# EAGLE design WeightGauge (EAGLE 8.2.1)
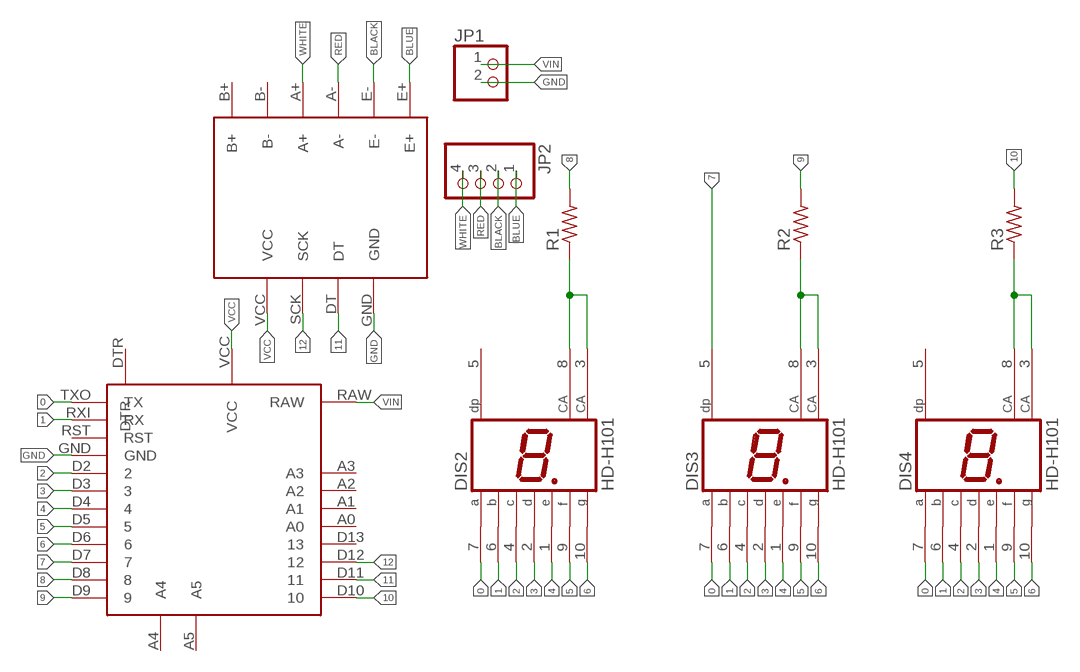
[diagram p0: schematic, sheet 1]

## Parts
DIS2  HD-H101  [HDSP-M]
DIS3  HD-H101  [HDSP-M]
DIS4  HD-H101  [HDSP-M]
JP1  PINHD-1X2/90  [1X02/90]
JP2  PINHD-1X4/90  [1X04/90]
R1  R-US_R1206  [R1206]
R2  R-US_R1206  [R1206]
R3  R-US_R1206  [R1206]
U$1  ARDUINO_PRO_MINI  [ARDUINO_PRO_MINI]
U$2  HX711  [HX711]

## Nets
0: DIS2.7(A) DIS3.7(A) DIS4.7(A) U$1.TXO(TX)
1: DIS2.6(B) DIS3.6(B) DIS4.6(B) U$1.RXI(RX)
2: DIS2.4(C) DIS3.4(C) DIS4.4(C) U$1.D2
3: DIS2.2(D) DIS3.2(D) DIS4.2(D) U$1.D3
4: DIS2.1(E) DIS3.1(E) DIS4.1(E) U$1.D4
5: DIS2.9(F) DIS3.9(F) DIS4.9(F) U$1.D5
6: DIS2.10(G) DIS3.10(G) DIS4.10(G) U$1.D6
7: DIS3.5(DP) U$1.D7
8: R1.2 U$1.D8
9: R2.2 U$1.D9
10: R3.2 U$1.D10
11: U$1.D11 U$2.DT
12: U$1.D12 U$2.SCK
BLACK: JP2.2 U$2.E-
BLUE: JP2.1 U$2.E+
GND [VCC]: JP1.2 U$1.GND U$2.GND
N$1: DIS2.3(CA) DIS2.8(CA) R1.1
N$2: DIS3.3(CA) DIS3.8(CA) R2.1
N$5: DIS4.3(CA) DIS4.8(CA) R3.1
RED: JP2.3 U$2.A-
VCC [VCC]: U$1.VCC U$2.VCC
VIN [VIN]: JP1.1 U$1.RAW
WHITE: JP2.4 U$2.A+
Unconnected: DIS2.5(DP) DIS4.5(DP) U$1.A0 U$1.A1 U$1.A2 U$1.A3 U$1.A4 U$1.A5 U$1.D13 U$1.DTR U$1.RST U$2.B+ U$2.B-

## Library data of the parts
DIS2-DIS4 = display-hp:HD-H101: LED DISPLAY 1-character 7 segment, decimal point right; OC_FARNELL: unknown; OC_NEWARK: unknown
JP1 = pinhead:PINHD-1X2: PIN HEADER
JP2 = pinhead:PINHD-1X4: PIN HEADER
R1-R3 = rcl:R-US_: RESISTOR, American symbol
U$1 = unclepetes:ARDUINO_PRO_MINI
U$2 = HX711:HX711

## Net classes
0 default: width 0.406 mm
1 VIN: width 0.61 mm
2 VCC: width 0.406 mm

## Board
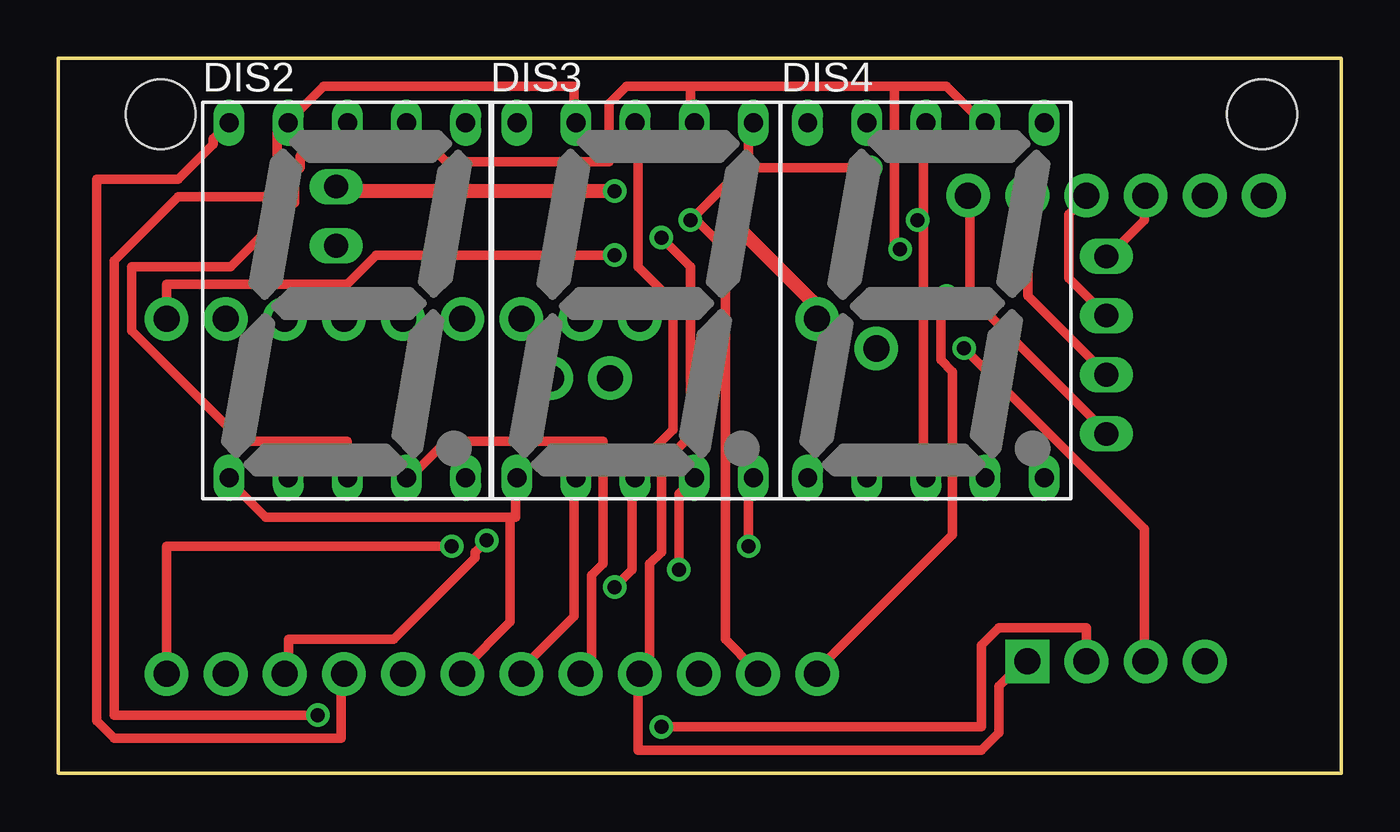
[diagram p1: board, top side]
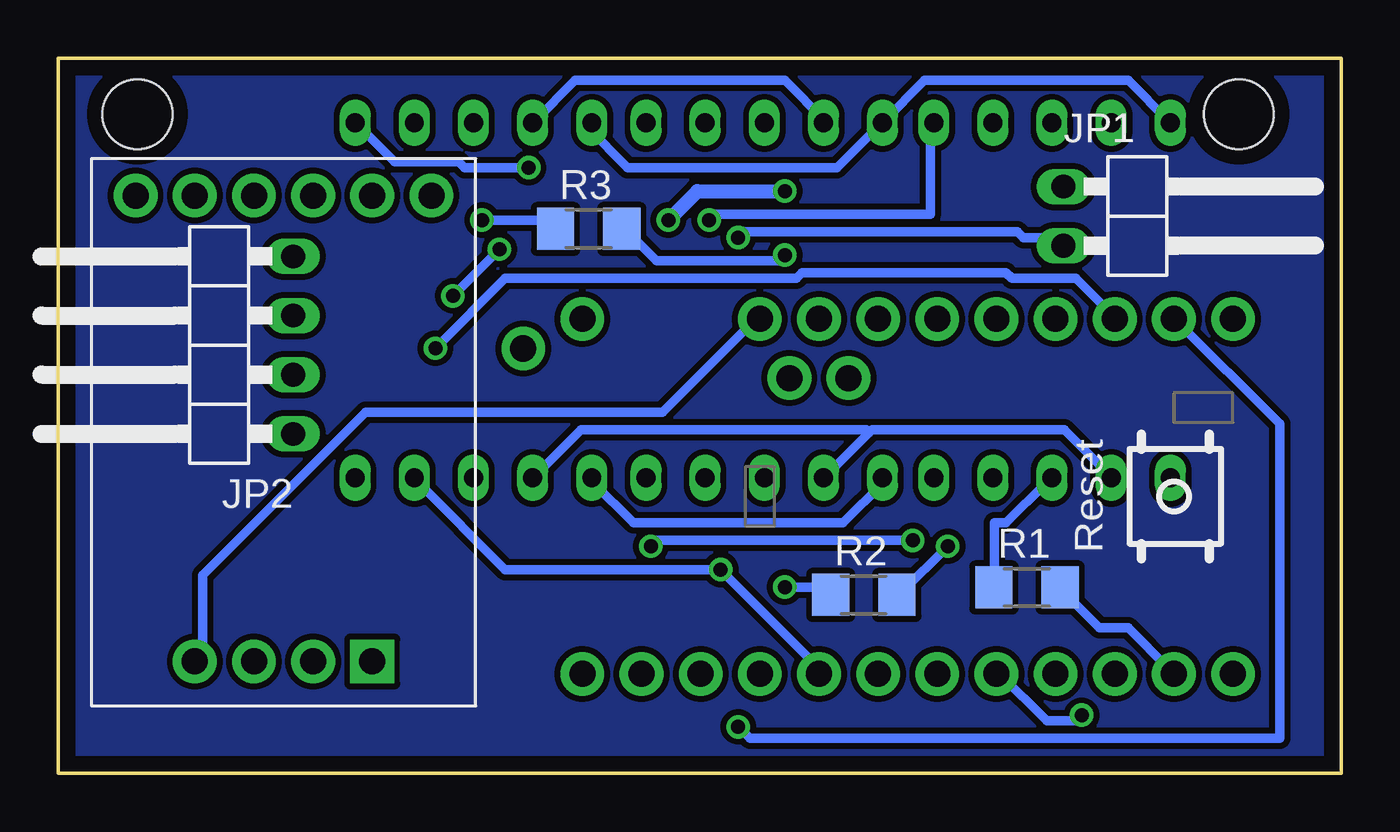
[diagram p2: board, bottom side, seen from below]

Size 55.1 x 30.7 mm. Coordinates in mm from the lower left corner, seen from the top.
Outline: 0,0 55.1,0 55.1,30.7 0,30.7 0,0
Copper layers (1*16): Top 0.035mm / dielectric 1.5mm / Bottom 0.035mm
Design rules "default *": minimum track width 10mil, minimum drill 0.6mm, track to track 10mil, track to pad 10mil, pad to pad 10mil, via to via 12mil, smd to smd 8mil, copper to edge 26mil, drill to drill 12mil, minimum pad ring 10mil, minimum via ring 8mil, stop-mask expansion 1mil, vias tented up to drill 30mil, thermal gap 10mil
Holes 3 mm at 51.7,28.3 4.4,28.3

### Footprints (pad centres in the part's own frame; a part is rotated, then mirrored left to right if it is on the bottom)
HDSP-M = drill 0.813 long: 1 -5.08,-7.62; 2 -2.54,-7.62; 3 0,-7.62; 4 2.54,-7.62; 5 5.08,-7.62; 6 5.08,7.62; 7 2.54,7.62; 8 0,7.62; 9 -2.54,7.62; 10 -5.08,7.62
1X02/90 = drill 1.016 long: 1 -1.27,-3.81; 2 1.27,-3.81
1X04/90 = drill 1.016 long: 1 -3.81,-3.81; 2 -1.27,-3.81; 3 1.27,-3.81; 4 3.81,-3.81
R1206 = smd 1.6 x 1.803: 1 -1.422,0; 2 1.422,0
ARDUINO_PRO_MINI = drill 1.118 pad 1.88: A0 16.51,11.43; A1 16.51,13.97; A2 16.51,16.51; A3 16.51,19.05; A4 13.97,17.78; A5 13.97,20.32; D2 1.27,19.05; D3 1.27,16.51; D4 1.27,13.97; D5 1.27,11.43; D6 1.27,8.89; D7 1.27,6.35; D8 1.27,3.81; D9 1.27,1.27; D10 16.51,1.27; D11 16.51,3.81; D12 16.51,6.35; D13 16.51,8.89; DTR 15.24,31.75; GND 1.27,21.59; RAW 16.51,29.21; RST 1.27,24.13; RXI 1.27,26.67; TXO 1.27,29.21; VCC 16.51,21.59
HX711 = drill 1.118 pad 1.88: A+ -1.27,20; A- 1.27,20; B+ -6.35,20; B- -3.81,20; DT 1.27,0; E+ 6.35,20; E- 3.81,20; SCK -1.27,0; VCC -3.81,0 | drill 1.118 pad 1.88 square: GND 3.81,0

### Placement (x,y rotation side)
DIS2  12.42,20.3 0 top
DIS3  24.78,20.3 0 top
DIS4  37.27,20.3 0 top
JP1  8.12,23.92 270 bottom
JP2  48.82,18.39 90 bottom
R1  13.49,7.98 0 bottom
R2  20.51,7.66 0 bottom
R3  32.32,23.38 0 bottom
U$1  3.38,3 90 bottom
U$2  45.42,4.8 0 bottom

### Tracks (layer width: path | path; a pad name or v marks a point on that pad's centre or on a via)
0  (via drill 0.6)
  Top 0.406: 27.15,29.5 24.4,29.5 23.65,28.75 23.65,26.25 16.65,26.25 15.15,27.75 DIS2.7 | 27.15,29.5 27.15,28 DIS3.7 | 27.15,29.5 35.9,29.5 | 35.9,29.5 38.15,29.5 39.65,28 DIS4.7 | v38.15,20.5 37.9,20.25 37.9,17.75 38.4,17.25 38.4,10.25 32.65,4.5 U$1.TXO | v36.15,22.5 35.9,22.75 35.9,29.5
  Bottom 0.406: v36.15,22.5 v38.15,20.5
1  (via drill 0.6)
  Top 0.406: 29.52,26.12 29.65,26.25 29.65,27.75 DIS3.6 | 29.52,26.12 v27.15,23.75 27.4,23.75 28.65,22.5 28.65,5.75 29.9,4.5 U$1.RXI | v34.9,26 29.65,26 29.52,26.12
  Bottom 0.406: v27.15,23.75 26.9,24 17.65,24 17.65,27.75 DIS2.6 | v34.9,26 37.65,26 37.9,26.25 40.65,26.25 42.15,27.75 DIS4.6
2  (via drill 0.6)
  Top 0.406: DIS2.4 15.15,12.75 16.65,14.25 23.4,14.25 23.4,9 22.9,8.5 22.9,4.75 22.65,4.5 U$1.D2 | v26.65,8.75 26.65,12 27.15,12.5 DIS3.4
  Bottom 0.406: U$1.D2 22.4,4.5 v26.65,8.75 35.9,8.75 39.65,12.5 DIS4.4
3
  Top 0.406: U$1.D3 19.9,4.5 22.15,6.75 22.15,12.5 DIS3.2
  Bottom 0.406: 20.27,14.62 22.15,12.75 DIS3.2 | 20.27,14.62 20.15,14.75 11.9,14.75 9.9,12.75 DIS2.2 | DIS4.2 34.65,12.75 32.65,14.75 20.4,14.75 20.27,14.62
4
  Top 0.406: 19.4,11 19.65,11 19.65,12.5 DIS3.1 | 19.4,11 8.9,11 7.4,12.5 DIS2.1 | 19.4,11 19.4,6.5 17.4,4.5 U$1.D4
  Bottom 0.406: DIS4.1 32.15,12.5 30.4,10.75 21.4,10.75 19.65,12.5 DIS3.1
5  (via drill 0.6)
  Top 0.406: DIS3.9 22.15,28 22.15,29.5 11.4,29.5 9.9,28 DIS2.9 9.65,27.75 9.4,27.5 9.4,24.75 5.15,24.75 2.4,22 2.4,2.5 v11.15,2.5
  Bottom 0.406: DIS4.9 34.65,28 32.9,29.75 23.9,29.75 22.15,28 DIS3.9 | v11.15,2.5 11.4,2.25 12.65,2.25 14.65,4.25 U$1.D5
6
  Top 0.406: DIS2.10 7.15,27.75 6.65,27.25 6.65,27 5.15,25.5 1.65,25.5 1.65,2.25 2.4,1.5 12.15,1.5 12.15,4.25 U$1.D6
  Bottom 0.406: DIS4.10 32.4,27.75 30.65,26 21.65,26 19.9,27.75 DIS3.10 19.65,28 17.9,29.75 9.15,29.75 7.4,28 DIS2.10
7  (via drill 0.6)
  Top 0.406: v29.65,9.75 29.65,12.5 DIS3.5 | v18.4,10 17.9,9.5 17.9,9.25 14.4,5.75 9.9,5.75 9.9,4.5 U$1.D7
  Bottom 0.406: v29.65,9.75 29.4,10 v18.4,10
8
  Bottom 0.406: R1.2 11.9,7.75 10.4,6.25 9.15,6.25 7.4,4.5 U$1.D8
9  (via drill 0.6)
  Top 0.406: v16.9,9.75 4.65,9.75 U$1.D9
  Bottom 0.406: v16.9,9.75 18.9,7.75 R2.2
10  (via drill 0.6)
  Top 0.406: v23.9,22.25 13.65,22.25 12.4,21 4.65,21 U$1.D10
  Bottom 0.406: v23.9,22.25 24.15,22 29.4,22 30.65,23.25 R3.2
11  (via drill 0.6)
  Top 0.406: v25.9,2 39.65,2 39.65,5.5 40.4,6.25 44.15,6.25 44.15,5 U$2.DT
  Bottom 0.406: v25.9,2 25.4,1.5 2.65,1.5 2.65,15 7.15,19.5 U$1.D11
12  (via drill 0.6)
  Top 0.406: v38.9,18.25 46.65,10.5 46.65,5 U$2.SCK
  Bottom 0.406: v38.9,18.25 35.9,21.25 23.4,21.25 23.15,21.5 14.4,21.5 14.15,21.25 11.4,21.25 9.9,19.75 U$1.D12
BLACK
  Top 0.406: JP2.2 44.9,17.25 41.65,20.5 41.65,24.75 U$2.E-
BLUE
  Top 0.406: JP2.1 44.9,14.75 39.15,20.5 39.15,24.75 U$2.E+
GND  (via drill 0.6)
  Top 0.406: v25.9,23 27.15,21.75 27.15,14.5 25.9,13.25 25.9,9.5 25.4,9 25.4,4.75 25.15,4.5 U$1.GND 24.9,4.25 24.9,1 39.65,1 40.4,1.75 40.4,3.75 41.4,4.75 U$2.GND
  Bottom 0.406: v25.9,23 25.65,23.25 13.9,23.25 13.65,23 12.4,23 12.15,22.75 JP1.2
N$1
  Top 0.406: DIS2.8 12.4,27.75 11.15,26.5 10.4,26.5 10.4,26 10.15,25.75 10.15,24.5 7.4,21.75 3.15,21.75 3.15,19 7.9,14.25 12.4,14.25 12.4,12.75 DIS2.3
  Bottom 0.406: R1.1 14.9,8 14.9,10.75 14.4,10.75 12.65,12.5 DIS2.3
N$2  (via drill 0.6)
  Top 0.406: v23.9,8 24.65,8.75 24.65,12.5 DIS3.3 24.9,12.75 24.9,13.25 26.4,14.75 26.4,20.25 24.9,21.75 24.9,27.75 DIS3.8
  Bottom 0.406: v23.9,8 22.4,8 22.15,7.75 R2.1
N$3
  pour Bottom: 0,0 55.1,0 55.1,30.7 0,30.7
N$5  (via drill 0.6)
  Top 0.406: DIS4.8 37.15,27.75 37.15,24 v36.9,23.75 37.15,23.75 37.15,12.75 DIS4.3
  Bottom 0.406: v36.9,23.75 34.15,23.75 33.9,23.5 R3.1
RED
  Top 0.406: JP2.3 44.9,19.75 43.4,21.25 43.4,24 44.15,24.75 U$2.A-
VCC
  Bottom 0.406: U$1.VCC 25.15,19.5 29.15,15.5 41.9,15.5 48.9,8.5 48.9,5 49.15,5 U$2.VCC
VIN  (via drill 0.6)
  Top 0.61: v23.9,25 12.15,25 JP1.1 | v28.9,23.75 32.4,20.25 32.4,19.75 U$1.RAW
  Bottom 0.61: v23.9,25 27.65,25 v28.9,23.75
WHITE
  Top 0.406: JP2.4 45.15,22.25 46.65,23.75 46.65,24.75 U$2.A+